# Altium project WR_NIC.PrjPcb (part 6 of 6)

## Sheet 20-Power-P1V8.SchDoc
size B; SheetNumber: 20; SheetTotal: 22; SPICEModelCachePRDMSQGY: <root> / <DocumentId>PRDMSQGY</DocumentId> / <CacheFrame Number="0"> / <Model Name="emk105bj105_v-f" Kind="CKT"> / <Text>* EMK105BJ105_V-F     SPICE MODEL  ( General Type ) / *-------------------------------------------------------------------------------------------------------- / * Model Generated by TAIYO YUDEN Corporation (http://www.ty-top.com) / * Version 1.0 / * TAIYO YUDEN Control No. 170508_130520 / * Copyright(c) 2012 TAIYO YUDEN CO.,LTD. All Rights Reserved. / *-------------------------------------------------------------------------------------------------------- / * / * Products Name : Multilayer Ceramic Capacitors / * / * Characteristics : / *     Capacitance : 1 uF , Rated Voltage : 16V , TCC : X5R / *     Case Size : 1.0 x 0.5 / 0.039 x 0.02 [mm/inch] , Thickness : 0.5 / 0.02 [mm/inch] / *     (Conditions: Temperature = 25 degC , DC Bias Current/Voltage = 0A / 0V) / * / * Frequency Range : 40Hz - 3GHz / * / * External Node Assignments : / * / *  1  o---| |---o  2 / * / *-------------------------------------------------------------------------------------------------------- / .SubCkt EMK105BJ105_V-F 1 2 / **************************** / C0 1 110 0.68309u / Cm 1 101 0.26053u / C1 101 102 0.94076u / Rc1 101 102 1.9029k / C2 102 103 0.66707u / Rc2 102 103 120.36 / C3 103 110 0.57203u / Rc3 103 110 2.1097 / C2m 1 301 0.1871u / C21 301 302 3.2494u / Rc21 301 302 1.1117k / C22 302 303 2.1014u / Rc22 302 303 1.484k / C23 303 304 2.1172u / Rc23 303 304 1.3876k / C24 304 305 0.75729u / Rc24 304 305 332.59 / C25 305 306 0.94401u / Rc25 305 306 249.09 / C26 306 307 0.34674u / Rc26 306 307 28.352 / C27 307 308 0.37158u / Rc27 307 308 19.989 / C28 308 309 0.17933u / Rc28 308 309 31.748 / C29 309 110 0.016445u / Rc29 309 110 1.0592 / Rp0 1 110 100Meg / L0 110 120 0.2216n / Lm 120 130 0.1509n / L1 120 121 0.12659n / RL1 121 130 0.85161 / L2 120 122 0.15996n / RL2 122 130 0.42469 / L3 120 123 7.9543n / RL3 123 130 0.54643m / CR 120 124 0.24334u / LR 124 125 0.090738n / RR 125 130 68.076m / CL 130 140 2.7354p / LL 130 140 0.10762n / RL 130 140 50.614 / Rs 140 2 7.5416m / **************************** / .ends EMK105BJ105_V-F</Text> / </Model> / </CacheFrame> / </root>
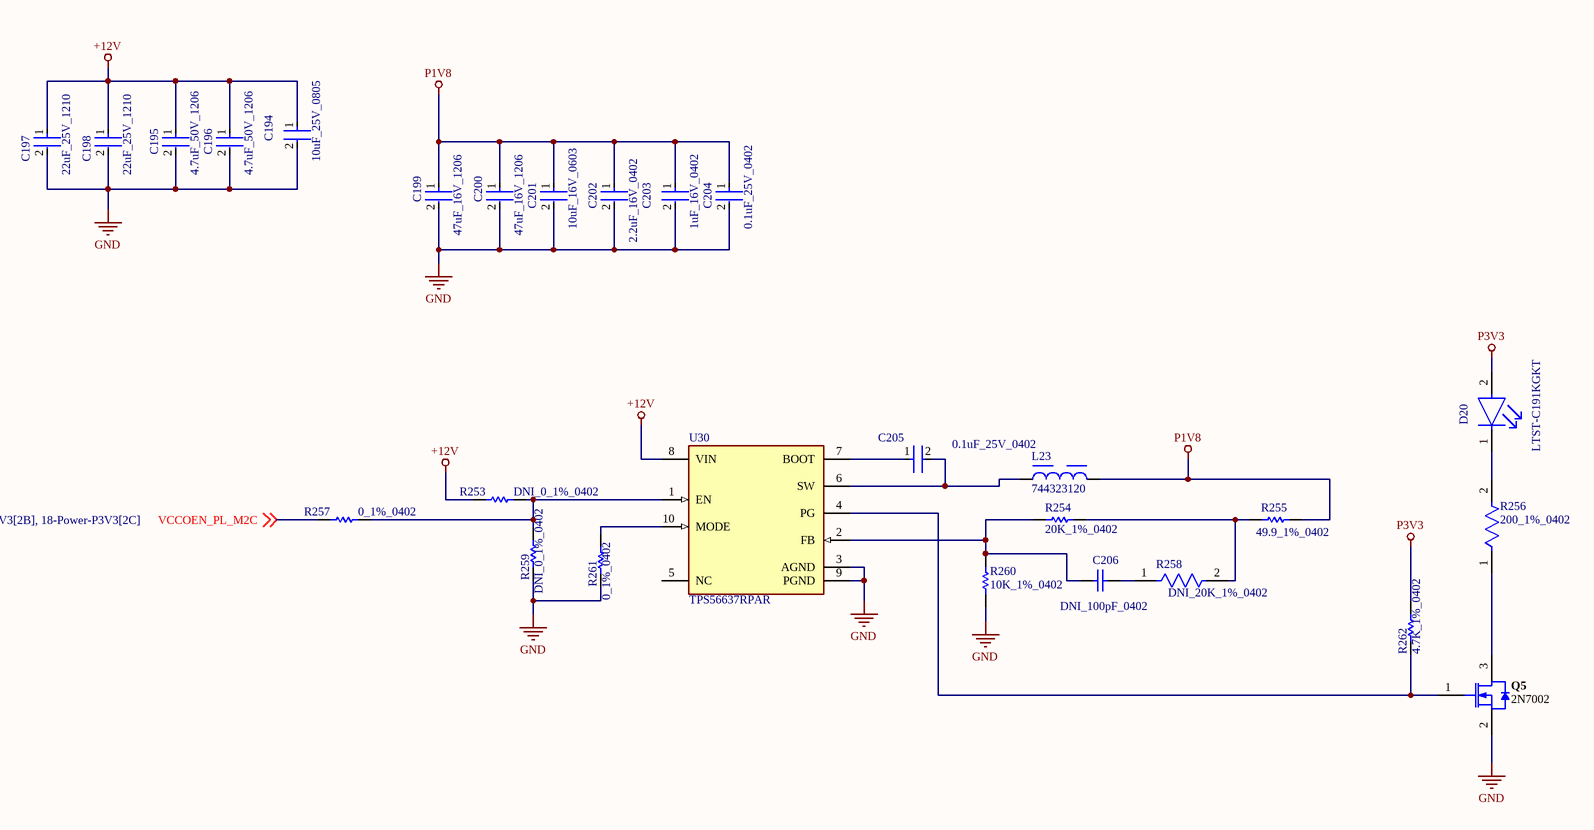
[diagram p20: 20-Power-P1V8.SchDoc]

### Parts
C194  10uF_25V_0805  [FP-0805-L_2_0_0_2-W_1_25-MFG]
C195  4.7uF_50V_1206  [FP-GRM31C-0_2-e0_3_0_8-IPC_C]
C196  4.7uF_50V_1206  [FP-GRM31C-0_2-e0_3_0_8-IPC_C]
C197  22uF_25V_1210  [FP-MK325M-MFG]
C198  22uF_25V_1210  [FP-MK325M-MFG]
C199  47uF_16V_1206  [FP-C3216-160-0_2-MFG]
C200  47uF_16V_1206  [FP-C3216-160-0_2-MFG]
C201  10uF_16V_0603  [FP-0603-L_1_6_0_2-W_0_8_0-MFG]
C202  2.2uF_16V_0402  [FP-C1005-050-0_05-IPC_A]
C203  1uF_16V_0402  [FP-0402-L_1_0_0_05-W_0_5-IPC_A]
C204  0.1uF_25V_0402  [FP-0402-L_1_0_1-W_0_5_0_1-IPC_C]
C205  0.1uF_25V_0402  [FP-0402-L_1_0_1-W_0_5_0_1-IPC_C]
C206  DNI_100pF_0402  [CAPC1005X55X25ML05T10]  (no BOM)
D20  LTST-C191KGKT  [FP-LTST-C191KGKT-MFG]
L23  744323120  [WE-HCI_1030]
Q5  2N7002  [INF-PG-SOT23_M]
R253  DNI_0_1%_0402  [RESC1005X40X25LL05T05]  (no BOM)
R254  20K_1%_0402  [RESC1005X40X25NL10T10]
R255  49.9_1%_0402  [RESC1005X40X25LL05T10]
R256  200_1%_0402  [FP-ERJ2RK-IPC_A]
R257  0_1%_0402  [RESC1005X40X25LL05T05]
R258  DNI_20K_1%_0402  [FP-ERJ2RK-MFG]  (no BOM)
R259  DNI_0_1%_0402  [RESC1005X40X25LL05T05]  (no BOM)
R260  10K_1%_0402  [RESC1005X40X25LL05T05]
R261  0_1%_0402  [RESC1005X40X25LL05T05]
R262  4.7K_1%_0402  [RESC1005X40X25NL10T10]
U30  TPS56637RPAR  [FP-RPA0010A-MFG]

### Nets
+12V: C194.1 C195.1 C196.1 C197.1 C198.1 R253.1 U30.8(VIN)
GND: C194.2 C195.2 C196.2 C197.2 C198.2 C199.2 C200.2 C201.2 C202.2 C203.2 C204.2 Q5.2(SOURCE) R259.1 R260.1 R261.1 U30.3(AGND) U30.9(PGND)
P1V8: C199.1 C200.1 C201.1 C202.1 C203.1 C204.1 L23.2 R255.2
P3V3: D20.2(A) R262.2
VCCOEN_PL_M2C: R257.1 ; off-sheet VCCOEN_PL_M2C
NetC205_1: C205.1 U30.7(BOOT)
NetC205_2: C205.2 L23.1 U30.6(SW)
NetC206_1: C206.1 R254.1 R260.2 U30.2(FB)
NetC206_2: C206.2 R258.1
NetD20_1: D20.1(C) R256.2
NetQ5_1: Q5.1(GATE) R262.1 U30.4(PG)
NetQ5_3: Q5.3(DRAIN) R256.1
NetR253_2: R253.2 R257.2 R259.2 U30.1(EN)
NetR254_2: R254.2 R255.1 R258.2
NetR261_2: R261.2 U30.10(MODE)

Not connected (* = marked no-connect by the designer): U30 5(NC)

### Library data of the parts
C194 = CMP-14477-000079-3: as C161 on sheet 18-Power-P3V3; Number of Pins: 2; Width: 0.049inch; REACH SVHC: No SVHC; Packaging: Tape and Reel; Max Operating Temperature: 85°C; Length: 0.079inch; Termination: SMD/SMT; RoHS Compliant: Yes; Thickness: 0.053inch; Case/Package: 0805; Case Code (Imperial): 0805; Capacitance: 10uF; Lead Free: Lead Free; Voltage Rating: 25V; Resistor Type: Ceramic; Voltage Rating (DC): 25V; Case Code (Metric): 2012; Mount: Surface Mount; Package Quantity: 1; Height: 1.25mm; Series: M; Tolerance: 10%; Min Operating Temperature: -55°C
C195 C196 = CMP-1037-04923-3: as C162 on sheet 18-Power-P3V3; Height: 1.6mm; Voltage: 50V; Capacitance: 4.7uF; Lead Free: Lead Free; Max Operating Temperature: 125°C; Packaging: Tape and Reel; REACH SVHC: No SVHC; Voltage Rating: 50V; Mount: Surface Mount; Termination: SMD/SMT; Tolerance: 10%; Case/Package: 1206; Material: Ceramic; Depth: 1.6mm; Length: 3.2mm; Case Code (Metric): 3216; Voltage Rating (DC): 50V; Case Code (Imperial): 1206; Radiation Hardening: No; Width: 0.063inch; Thickness: 0.071inch; Package Quantity: 2000; Min Operating Temperature: -55°C; Dielectric: X7R
C197 C198 = CMP-14477-000145-1: as C164 on sheet 18-Power-P3V3; Width: 0.098inch; Thickness: 0.106inch; Depth: 2.5mm; Packaging: Tape and Reel; Max Operating Temperature: 85°C; Termination: SMD/SMT; Case Code (Imperial): 1210; Height: 2.5mm; Case/Package: 1210; Voltage Rating: 25V; Package Quantity: 1; Min Operating Temperature: -55°C; Capacitance: 22uF; Halogen Free: Halogen Free; Case Code (Metric): 3225; Mount: Surface Mount; Construction: Flat; Radiation Hardening: No; Length: 3.2mm; Voltage Rating (DC): 25V; Contact Plating: Nickel; Number of Pins: 2; Dielectric: X5R; RoHS Compliant: Yes; Resistor Type: Ceramic; Series: M
C199 C200 = CMP-2000-07442-2: as C166 on sheet 18-Power-P3V3; Resistor Type: Ceramic; Width: 0.063inch; Case Code (Imperial): 1206; Radiation Hardening: No; Thickness: 0.071inch; Dielectric: X5R; Weight: 0.000571oz; Termination: SMD/SMT; Dielectric Material: Ceramic; Min Operating Temperature: -55°C; Depth: 1.6mm; Case Code (Metric): 3216; Max Operating Temperature: 85°C; RoHS Compliant: Yes; REACH SVHC: No SVHC; Mount: Surface Mount; Lead Free: Lead Free; Height: 1.6mm; Length: 3.2mm; Tolerance: 20%; Voltage Rating (DC): 16V; Capacitance: 47uF; Package Quantity: 1; Construction: Flat; Packaging: Tape and Reel; Series: C; Case/Package: 1206; Voltage Rating: 16V
C201 = CMP-2000-06226-4: as C168 on sheet 18-Power-P3V3; Packaging: Tape and Reel; Construction: Flat; Height: 0.8mm; Max Operating Temperature: 85°C; Dielectric: X5R; Case Code (Metric): 1608; Voltage Rating (DC): 16V; Width: 0.031inch; Voltage Rating: 16V; Length: 0.063inch; RoHS Compliant: Yes; Halogen Free: Halogen Free; Case Code (Imperial): 0603; Capacitance: 10uF; Mount: Surface Mount; Thickness: 0.031inch; Tolerance: 20%; Min Operating Temperature: -55°C; Series: M; Termination: SMD/SMT; Case/Package: 0603; Package Quantity: 1
C202 = CMP-2000-05998-2: as C169 on sheet 18-Power-P3V3; REACH SVHC: No SVHC; Series: C; Termination: SMD/SMT; Case Code (Imperial): 0402; Depth: 0.5mm; Mount: Surface Mount; Width: 0.02inch; Package Quantity: 1; Dielectric Material: Ceramic; Length: 1mm; Packaging: Tape and Reel; Case Code (Metric): 1005; RoHS Compliant: Yes; Dielectric: X5R; Max Operating Temperature: 85°C; Lead Free: Lead Free; Weight: 2.3E-05oz; Thickness: 0.022inch; Voltage Rating (DC): 16V; Tolerance: 10%; Voltage Rating: 16V; Resistor Type: Ceramic; Height: 0.5mm; Case/Package: 0402; Min Operating Temperature: -55°C
C203 = CMP-14477-000104-2: as C177 on sheet 18-Power-P3V3; Packaging: Tape and Reel; Depth: 0.5mm; Mount: Surface Mount; Thickness: 0.022inch; Package Quantity: 1; Min Operating Temperature: -55°C; Series: M; Voltage Rating (DC): 16V; Termination: SMD/SMT; Case/Package: 0402; Number of Pins: 2; Case Code (Imperial): 0402; Length: 1mm; Halogen Free: Halogen Free; Case Code (Metric): 1005; Width: 0.02inch; RoHS Compliant: Yes; Radiation Hardening: No; Max Operating Temperature: 85°C; Height: 0.5mm; Construction: Flat
C204 C205 = CMP-2008-02519-2: as C158 on sheet 17-FPGA-02b; Package Quantity: 1; Capacitance: 100nF; Min Operating Temperature: -55°C; Voltage: 25V; Voltage Rating: 25V; Construction: Flat; Max Operating Temperature: 125°C; Radiation Hardening: No; Depth: 0.5mm; Thickness: 0.022inch; Voltage Rating (DC): 25V; Number of Pins: 2; Lead Free: Lead Free; Series: -; REACH SVHC: No SVHC; Length: 1mm; Dielectric: X7R; RoHS Compliant: Yes; Mount: Surface Mount; Packaging: Tape and Reel; Case/Package: 0402; Case Code (Imperial): 0402; Termination: SMD/SMT; Width: 0.02inch; Case Code (Metric): 1005; Tolerance: 10%
C206 = CMP-2008-03915-1: as C180 on sheet 18-Power-P3V3
D20 = CMP-2000-05198-2: as D12 on sheet 18-Power-P3V3; Width: 0.8mm; Case Code (Imperial): 0603; Number of Pins: 2; Lead Free: Lead Free; Packaging: Tape and Reel; Package Quantity: 1; Min Operating Temperature: -55°C; Case/Package: 0603; Length: 1.6mm; Power Dissipation: 75mW; Depth: 0.8mm; Radiation Hardening: No; Mount: Surface Mount; Max Operating Temperature: 85°C; Color: Green; Power Rating: 75mW; Height: 0.55mm; Illumination Color: Green; Case Code (Metric): 1608; Lens Transparency: Clear; Number of Elements: 1
L23 = CMP-0226-00168-2: NexarPartId: 23379116; Self Resonant Frequency: 59MHz; Max DC Current: 12A; DC Resistance (DCR): 6.6mΩ; Shielding: Shielded; Saturation Current: 15A; Inductance Tolerance: 20%; Inductance: 1.2µH; Series Resistance: 6.6Ω; Test Frequency: 100kHz; Termination: SMD/SMT; Length: 10.6mm; REACH SVHC: No SVHC; Case/Package: Nonstandard; Width: 10.6mm; Min Operating Temperature: -40°C; Composition: Wirewound; Ambient Temperature Range Low: -40°C; Number of Pins: 2; Current Rating: 12A; Depth: 10.6mm; Height - Seated (Max): 3.0988mm; Max Operating Temperature: 150°C; Ambient Temperature Range High: 100°C; Packaging: Tape & Reel (TR); Mount: Surface Mount; Height: 2.8mm; Tolerance: 20%; RoHS: Compliant
Q5 = CMP-1149-00026-1: N-Channel OptiMOS Small-Signal-Transistor, 60 V VDS, 0.3 A ID, -55 to 150 degC, PG-SOT23, Reel, Green; Manufacturer: Infineon; RDS (on) (max) (@4.5V): 4,000 mOhm; VDS (max): 60 V; IDpuls (max): 1.2Â A; QG: 0.4Â nC; RDS (on) (max): 3,000 mOhm; RthJA (max): 250 K/W; ID (max): 0.3Â A; VGS(th) (max): 2.5Â V; VGS(th) (min): 1.5Â V; Green: TRUE; Ptot (max): 0.5Â W; PackageDescription: 3-Pin Small Outline Transistor Package, 2.9 x 1.3 mm Body, 0.95 mm Pitch; Halogen-free: TRUE; ComponentLink2Description: Datasheet; ComponentLink1URL: http://www.infineon.com/; Packing: Reel; DatasheetVersion: Rev. 2.4; PartNumber: 2N7002; PackageReference: PG-SOT23; PackageVersion: Apr-08; ComponentLink3URL: http://www.infineon.com/dgdl/SOT23-Package_Overview.pdf?folderId=db3a30431936bc4b0119532290053c66&fileId=db3a30431936bc4b0119533468123c85; ComponentLink1Description: Manufacturer URL; Mounting Technology: Surface Mount; ComponentLink3Description: Package Specification; ComponentLink2URL: http://www.infineon.com/dgdl/2N7002_Rev2.4.pdf?folderId=db3a3043156fd573011622e10b5c1f67&fileId=db3a304319bc939a0119c2a9461e79e6
R253 R257 R259 R261 = CMP-2000-07451-1: as R153 on sheet 17-FPGA-02b; Number of Terminations: 2; Mount: SurfaceMount; Height: 0.35mm; Packaging: TapeandReel; Contact Plating: Tin; Manufacturer URL: http://www.panasonic.com/; Composition: ThickFilm; Max Operating Temperature: 155degC; REACH SVHC: NoSVHC; Case/Package: 0402; Package Reference: 402; Depth: 0.5mm; Package Description: 2-Pin Surface Mount Device, Body 1 x 0.5 mm; Datasheet URL: https://industrial.panasonic.com/cdbs/www-data/pdf/RDA0000/AOA0000C301.pdf; RoHSCompliant: True; Case Code (Imperial): 0402; Military Standard: Not; Min Operating Temperature: -55degC; Power Rating: 100mW; Datasheet Version: 03/2015; Length: 1mm; Case Code (Metric): 1005; Termination: SMD/SMT; Mounting Technology: SurfaceMount; Voltage Rating: 50V; Width: 0.02inch; Package Quantity: 1; Lead Free: LeadFree; Radiation Hardening: No
R254 = CMP-2002-06039-1: as R173 on sheet 19-Power-P5V
R255 = CMP-2002-07709-1: as R159 on sheet 18-Power-P3V3
R256 = CMP-2002-00757-2: as R155 on sheet 18-Power-P3V3; RoHS Compliant: Yes; Packaging: Tape and Reel; Case Code (Metric): 1005; Package Quantity: 1; Contact Plating: Tin; Series: ERJ; Mount: Surface Mount; Lead Free: Lead Free; Min Operating Temperature: -55°C; Number of Terminations: 2; Max Power Dissipation: 100mW; Technology: THICK FILM; Voltage Rating: 50V; Case/Package: 0402; Width: 0.02inch; Termination: SMD/SMT; Military Standard: Not; Height: 0.35mm; Radiation Hardening: No; Resistance Tolerance: 1%; Length: 1mm; REACH SVHC: No SVHC; Construction: Rectangular; Depth: 0.5mm; Features: Automotive AEC-Q200; Resistor Type: Thick Film; Case Code (Imperial): 0402; Tolerance: 1%; Size Code: 0402; Max Operating Temperature: 155°C
R258 = CMP-2002-00759-4: as R160 on sheet 18-Power-P3V3; Radiation Hardening: No; Case/Package: 0402; Case Code (Metric): 1005; Min Operating Temperature: -55°C; Termination: SMD/SMT; Package Quantity: 1; Length: 1mm; Case Code (Imperial): 0402; Lead Free: Lead Free; Height: 0.35mm; Max Operating Temperature: 155°C; Depth: 0.5mm; Number of Terminations: 2; Military Standard: Not; Max Power Dissipation: 100mW; Tolerance: 1%; Composition: Thick Film; Weight: 2.8E-05oz; Features: Automotive AEC-Q200; Voltage Rating: 50V; Contact Plating: Tin; REACH SVHC: No SVHC; Width: 0.02inch; Packaging: Cut Tape; Mount: Surface Mount
R260 = CMP-2000-07588-1: as R152 on sheet 17-FPGA-02b; RoHSCompliant: True; Lead Free: LeadFree; Package Quantity: 1; Contact Plating: Tin; Length: 1mm; Radiation Hardening: No; REACH SVHC: NoSVHC; Max Operating Temperature: 155degC; Depth: 0.5mm; Case Code (Imperial): 0402; Military Standard: Not; Package Description: 2-Pin Surface Mount Device, Body 1 x 0.5 mm; Termination: SMD/SMT; Case Code (Metric): 1005; Height: 0.35mm; Packaging: TapeandReel; Voltage Rating (DC): 50V; Package Reference: 402; Number of Pins: 2; Tolerance: 1%; Mounting Technology: SurfaceMount; Width: 0.02inch; Mount: SurfaceMount; Datasheet URL: https://industrial.panasonic.com/cdbs/www-data/pdf/RDA0000/AOA0000C304.pdf; Composition: ThickFilm; Datasheet Version: 02/2017; Manufacturer URL: http://www.panasonic.com/; Max Power Dissipation: 100mW; Number of Terminations: 2; Min Operating Temperature: -55degC
R262 = CMP-2002-05217-1: Manufacturer: Bourns; Part Number: CR0402-FX-4701GLF
U30 = CMP-04918-000008-1: as U28 on sheet 18-Power-P3V3; Automotive: No; Manufacturer Part Number: TPS56637RPAR; Lead Free: Yes; Temperature Range Low: -40°C; Digikey Description: IC POWER MANAGEMENT; Octopart: https://octopart.com/tps56637rpar-texas+instruments-97650653; Temperature: -40°C to +150°C; Device Class L3: Voltage Regulators - Switching; Temperature Range High: +150°C; Package: RPA0010A; Device Class L2: Power Management ICs; ComponentLink2URL: http://www.ti.com/lit/ds/symlink/tps56637.pdf; Device Class L1: Integrated Circuits (ICs); RoHS: TRUE; ComponentLink2Description: Datasheet; Height: 1mm; Category: IC

## Sheet 21-M2_GNSS.SchDoc
size B; SheetNumber: 21; SheetTotal: 22
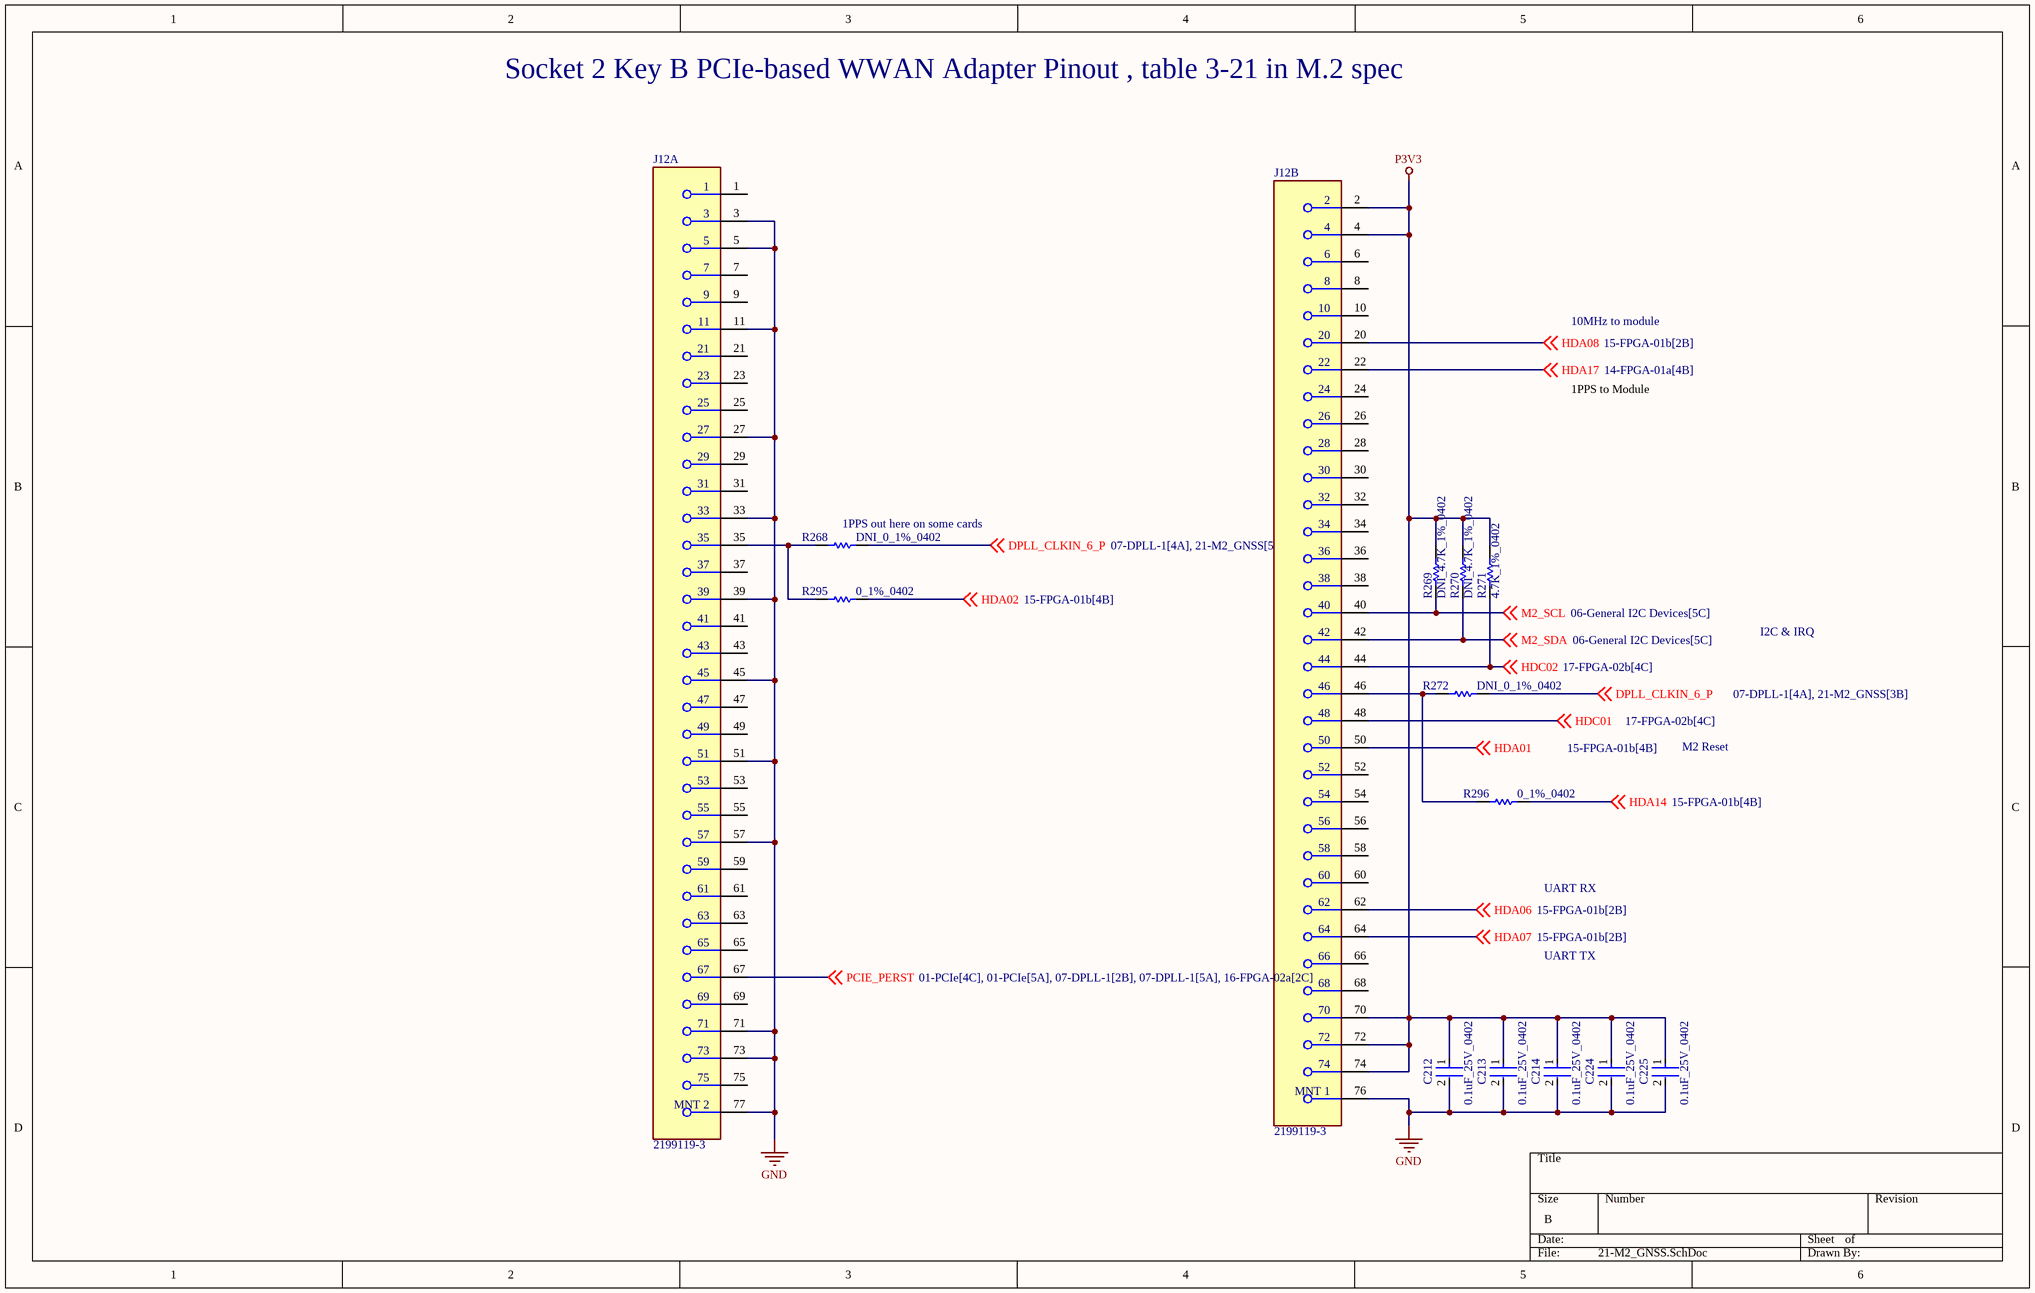
[diagram p21: 21-M2_GNSS.SchDoc]

### Parts
C212  0.1uF_25V_0402  [FP-0402-L_1_0_1-W_0_5_0_1-IPC_C]
C213  0.1uF_25V_0402  [FP-0402-L_1_0_1-W_0_5_0_1-IPC_C]
C214  0.1uF_25V_0402  [FP-0402-L_1_0_1-W_0_5_0_1-IPC_C]
C224  0.1uF_25V_0402  [FP-0402-L_1_0_1-W_0_5_0_1-IPC_C]
C225  0.1uF_25V_0402  [FP-0402-L_1_0_1-W_0_5_0_1-IPC_C]
J12  2199119-3  [FP-2199119-3-MFG]  (parts A,B of 2)
R268  DNI_0_1%_0402  [RESC1005X40X25LL05T05]  (no BOM)
R269  DNI_4.7K_1%_0402  [RESC1005X40X25NL10T10]  (no BOM)
R270  DNI_4.7K_1%_0402  [RESC1005X40X25NL10T10]  (no BOM)
R271  4.7K_1%_0402  [RESC1005X40X25NL10T10]
R272  DNI_0_1%_0402  [RESC1005X40X25LL05T05]  (no BOM)
R295  0_1%_0402  [RESC1005X40X25LL05T05]
R296  0_1%_0402  [RESC1005X40X25LL05T05]

### Nets
GND: C212.2 C213.2 C214.2 C224.2 C225.2 J12.3 J12.5 J12.11 J12.27 J12.33 J12.39 J12.45 J12.51 J12.57 J12.71 J12.73 J12.76(MNT_1) J12.77(MNT_2)
P3V3: C212.1 C213.1 C214.1 C224.1 C225.1 J12.2 J12.4 J12.70 J12.72 J12.74 R269.2 R270.2 R271.2
DPLL_CLKIN_6_P: R268.2 R272.2 ; off-sheet DPLL_CLKIN_6_P
HDA01: J12.50 ; off-sheet HDA01
HDA02: R295.2 ; off-sheet HDA02
HDA06: J12.62 ; off-sheet HDA06
HDA07: J12.64 ; off-sheet HDA07
HDA08: J12.20 ; off-sheet HDA08
HDA14: R296.2 ; off-sheet HDA14
HDA17: J12.22 ; off-sheet HDA17
HDC01: J12.48 ; off-sheet HDC01
HDC02: J12.44 R271.1 ; off-sheet HDC02
M2_SCL: J12.40 R269.1 ; off-sheet M2_SCL
M2_SDA: J12.42 R270.1 ; off-sheet M2_SDA
PCIE_PERST: J12.67 ; off-sheet PCIE_PERST
NetJ12_35: J12.35 R268.1 R295.1
NetJ12_46: J12.46 R272.1 R296.1

Not connected (* = marked no-connect by the designer): J12 1 6 7 8 9 10 21 23 24 25 26 28 29 30 31 32 34 36 37 38 41 43 47 49 52 53 54 55 56 58 59 60 61 63 65 66 68 69 75

### Notes on the sheet
- Socket 2 Key B PCIe-based WWAN Adapter Pinout , table 3-21 in M.2 spec
- 10MHz to module
- 1PPS to Module
- (near R268) 1PPS out here on some cards
- I2C & IRQ
- M2 Reset
- UART RX
- UART TX

### Library data of the parts
C212-C214 C224 C225 = CMP-2008-02519-2: as C158 on sheet 17-FPGA-02b; Package Quantity: 1; Capacitance: 100nF; Min Operating Temperature: -55°C; Voltage: 25V; Voltage Rating: 25V; Construction: Flat; Max Operating Temperature: 125°C; Radiation Hardening: No; Depth: 0.5mm; Thickness: 0.022inch; Voltage Rating (DC): 25V; Number of Pins: 2; Lead Free: Lead Free; Series: -; REACH SVHC: No SVHC; Length: 1mm; Dielectric: X7R; RoHS Compliant: Yes; Mount: Surface Mount; Packaging: Tape and Reel; Case/Package: 0402; Case Code (Imperial): 0402; Termination: SMD/SMT; Width: 0.02inch; Case Code (Metric): 1005; Tolerance: 10%
J12 = CMP-03365-000004-1: CONN M.2 FEMALE 67POS 0.020 GOLD; Contact Current Rating: 500mA; Number of Contacts: 67; PCB Mounting Orientation: Right Angle; Pitch: 0.5mm; Voltage Rating: 50V; Insulation Resistance: 500MR; Row Spacing: 7.55mm; Orientation: Right Angle; Length: 0.862inch; Radiation Hardening: No; Mount: Surface Mount; Contact Plating: Gold; Contact Material: Copper Alloy; Width: 8.7mm; Number of Rows: 2; Color: Black; ELV: Compliant; Housing Color: Black; Number of Positions: 67; Housing Material: Thermoplastic; Gender: Female; Min Operating Temperature: -40°C; Max Operating Temperature: 80°C; RoHS Compliant: Yes; Package Quantity: 1200; Packaging: Tape and Reel; Height: 3.2mm; Termination: Solder; Insulation Material: Thermoplastic; Max Voltage Rating (AC): 50V; Current Rating: 500mA
R268 R272 R295 R296 = CMP-2000-07451-1: as R153 on sheet 17-FPGA-02b; Number of Terminations: 2; Mount: SurfaceMount; Height: 0.35mm; Packaging: TapeandReel; Contact Plating: Tin; Manufacturer URL: http://www.panasonic.com/; Composition: ThickFilm; Max Operating Temperature: 155degC; REACH SVHC: NoSVHC; Case/Package: 0402; Package Reference: 402; Depth: 0.5mm; Package Description: 2-Pin Surface Mount Device, Body 1 x 0.5 mm; Datasheet URL: https://industrial.panasonic.com/cdbs/www-data/pdf/RDA0000/AOA0000C301.pdf; RoHSCompliant: True; Case Code (Imperial): 0402; Military Standard: Not; Min Operating Temperature: -55degC; Power Rating: 100mW; Datasheet Version: 03/2015; Length: 1mm; Case Code (Metric): 1005; Termination: SMD/SMT; Mounting Technology: SurfaceMount; Voltage Rating: 50V; Width: 0.02inch; Package Quantity: 1; Lead Free: LeadFree; Radiation Hardening: No
R269-R271 = CMP-2002-05217-1: as R262 on sheet 20-Power-P1V8

## Sheet 22-1G_SFP.SchDoc
size B; SheetNumber: 22; SheetTotal: 22
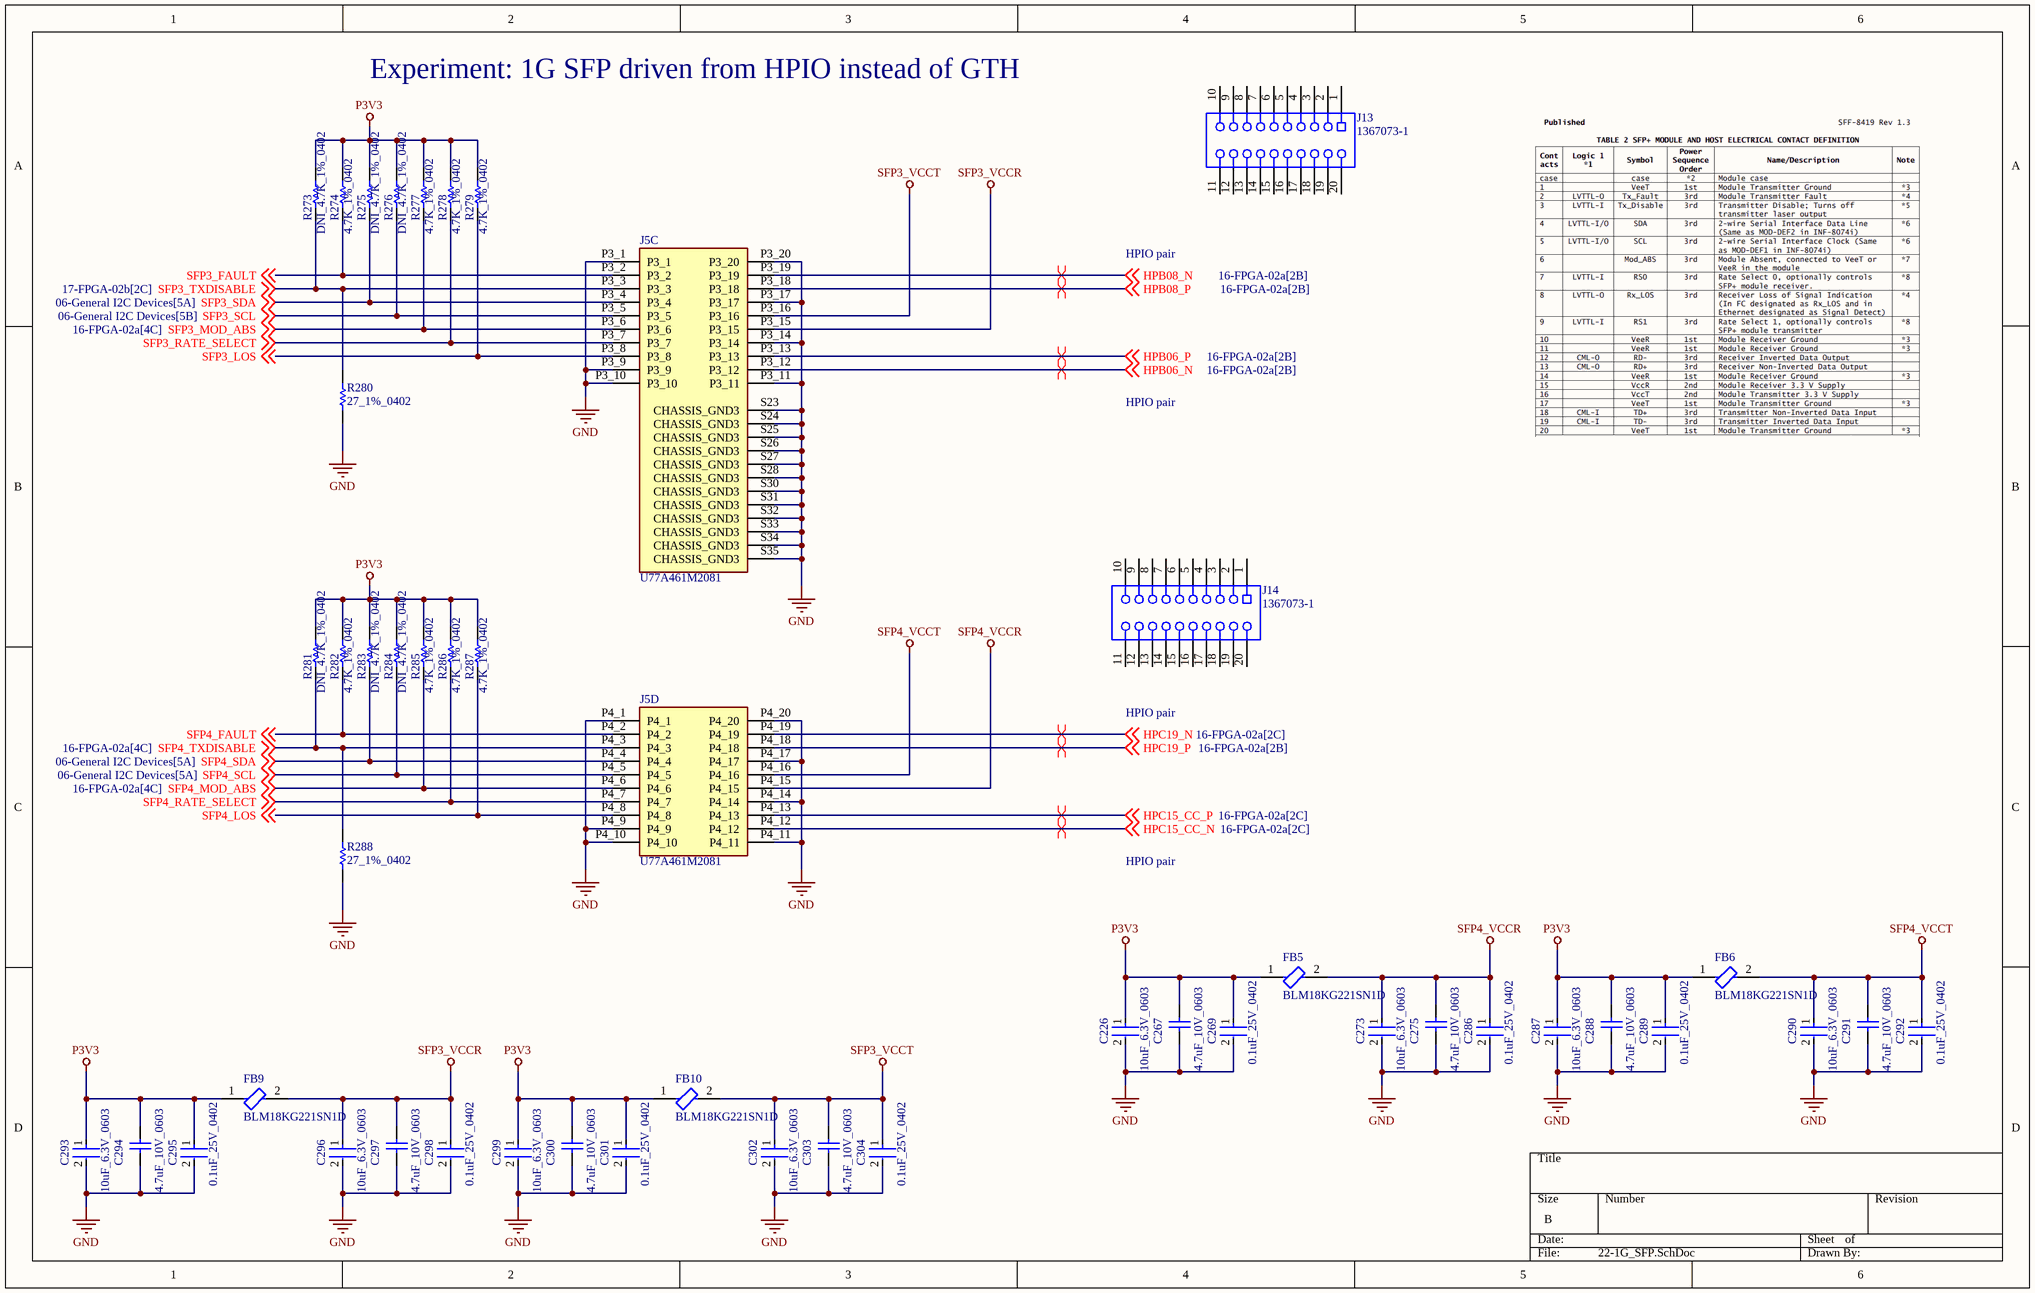
[diagram p22: 22-1G_SFP.SchDoc]

### Parts
C226  10uF_6.3V_0603  [FP-C0603C106M9PACTU-MFG]
C267  4.7uF_10V_0603  [CAPC1608X87X35NL15T15]
C269  0.1uF_25V_0402  [FP-0402-L_1_0_1-W_0_5_0_1-IPC_C]
C273  10uF_6.3V_0603  [FP-C0603C106M9PACTU-MFG]
C275  4.7uF_10V_0603  [CAPC1608X87X35NL15T15]
C286  0.1uF_25V_0402  [FP-0402-L_1_0_1-W_0_5_0_1-IPC_C]
C287  10uF_6.3V_0603  [FP-C0603C106M9PACTU-MFG]
C288  4.7uF_10V_0603  [CAPC1608X87X35NL15T15]
C289  0.1uF_25V_0402  [FP-0402-L_1_0_1-W_0_5_0_1-IPC_C]
C290  10uF_6.3V_0603  [FP-C0603C106M9PACTU-MFG]
C291  4.7uF_10V_0603  [CAPC1608X87X35NL15T15]
C292  0.1uF_25V_0402  [FP-0402-L_1_0_1-W_0_5_0_1-IPC_C]
C293  10uF_6.3V_0603  [FP-C0603C106M9PACTU-MFG]
C294  4.7uF_10V_0603  [CAPC1608X87X35NL15T15]
C295  0.1uF_25V_0402  [FP-0402-L_1_0_1-W_0_5_0_1-IPC_C]
C296  10uF_6.3V_0603  [FP-C0603C106M9PACTU-MFG]
C297  4.7uF_10V_0603  [CAPC1608X87X35NL15T15]
C298  0.1uF_25V_0402  [FP-0402-L_1_0_1-W_0_5_0_1-IPC_C]
C299  10uF_6.3V_0603  [FP-C0603C106M9PACTU-MFG]
C300  4.7uF_10V_0603  [CAPC1608X87X35NL15T15]
C301  0.1uF_25V_0402  [FP-0402-L_1_0_1-W_0_5_0_1-IPC_C]
C302  10uF_6.3V_0603  [FP-C0603C106M9PACTU-MFG]
C303  4.7uF_10V_0603  [CAPC1608X87X35NL15T15]
C304  0.1uF_25V_0402  [FP-0402-L_1_0_1-W_0_5_0_1-IPC_C]
FB5  BLM18KG221SN1D  [FP-BLM18-0_15-t0_8-IPC_B]
FB6  BLM18KG221SN1D  [FP-BLM18-0_15-t0_8-IPC_B]
FB9  BLM18KG221SN1D  [FP-BLM18-0_15-t0_8-IPC_B]
FB10  BLM18KG221SN1D  [FP-BLM18-0_15-t0_8-IPC_B]
J5  U77A461M2081  [AMPHENOL_U77A461M2081]  (parts C,D of 4)
J13  1367073-1  [TECO-1367073-1_V]
J14  1367073-1  [TECO-1367073-1_V]
R273  DNI_4.7K_1%_0402  [RESC1005X40X25NL10T10]  (no BOM)
R274  4.7K_1%_0402  [RESC1005X40X25NL10T10]
R275  DNI_4.7K_1%_0402  [RESC1005X40X25NL10T10]  (no BOM)
R276  DNI_4.7K_1%_0402  [RESC1005X40X25NL10T10]  (no BOM)
R277  4.7K_1%_0402  [RESC1005X40X25NL10T10]
R278  4.7K_1%_0402  [RESC1005X40X25NL10T10]
R279  4.7K_1%_0402  [RESC1005X40X25NL10T10]
R280  27_1%_0402  [RESC1005X40X25NL05T05]
R281  DNI_4.7K_1%_0402  [RESC1005X40X25NL10T10]  (no BOM)
R282  4.7K_1%_0402  [RESC1005X40X25NL10T10]
R283  DNI_4.7K_1%_0402  [RESC1005X40X25NL10T10]  (no BOM)
R284  DNI_4.7K_1%_0402  [RESC1005X40X25NL10T10]  (no BOM)
R285  4.7K_1%_0402  [RESC1005X40X25NL10T10]
R286  4.7K_1%_0402  [RESC1005X40X25NL10T10]
R287  4.7K_1%_0402  [RESC1005X40X25NL10T10]
R288  27_1%_0402  [RESC1005X40X25NL05T05]

### Nets
GND: C226.2 C267.1 C269.2 C273.2 C275.1 C286.2 C287.2 C288.1 C289.2 C290.2 C291.1 C292.2 C293.2 C294.1 C295.2 C296.2 C297.1 C298.2 C299.2 C300.1 C301.2 C302.2 C303.1 C304.2 J5.P3_1 J5.P3_9 J5.P3_10 J5.P3_11 J5.P3_14 J5.P3_17 J5.P3_20 J5.P4_1 J5.P4_9 J5.P4_10 J5.P4_11 J5.P4_14 J5.P4_17 J5.P4_20 J5.S23(CHASSIS_GND3) J5.S24(CHASSIS_GND3) J5.S25(CHASSIS_GND3) J5.S26(CHASSIS_GND3) J5.S27(CHASSIS_GND3) J5.S28(CHASSIS_GND3) J5.S30(CHASSIS_GND3) J5.S31(CHASSIS_GND3) J5.S32(CHASSIS_GND3) J5.S33(CHASSIS_GND3) J5.S34(CHASSIS_GND3) J5.S35(CHASSIS_GND3) R280.1 R288.1
P3V3: C226.1 C267.2 C269.1 C287.1 C288.2 C289.1 C293.1 C294.2 C295.1 C299.1 C300.2 C301.1 FB5.1 FB6.1 FB9.1 FB10.1 R273.1 R274.1 R275.1 R276.1 R277.1 R278.1 R279.1 R281.1 R282.1 R283.1 R284.1 R285.1 R286.1 R287.1
SFP3_VCCR: C296.1 C297.2 C298.1 FB9.2 J5.P3_15
SFP3_VCCT: C302.1 C303.2 C304.1 FB10.2 J5.P3_16
SFP4_VCCR: C273.1 C275.2 C286.1 FB5.2 J5.P4_15
SFP4_VCCT: C290.1 C291.2 C292.1 FB6.2 J5.P4_16
HPB06_N: J5.P3_12 ; off-sheet HPB06_N
HPB06_P: J5.P3_13 ; off-sheet HPB06_P
HPB08_N: J5.P3_19 ; off-sheet HPB08_N
HPB08_P: J5.P3_18 ; off-sheet HPB08_P
HPC15_CC_N: J5.P4_12 ; off-sheet HPC15_CC_N
HPC15_CC_P: J5.P4_13 ; off-sheet HPC15_CC_P
HPC19_N: J5.P4_19 ; off-sheet HPC19_N
HPC19_P: J5.P4_18 ; off-sheet HPC19_P
SFP3_FAULT: J5.P3_2 R274.2 ; off-sheet SFP3_FAULT
SFP3_LOS: J5.P3_8 R279.2 ; off-sheet SFP3_LOS
SFP3_MOD_ABS: J5.P3_6 R277.2 ; off-sheet SFP3_MOD_ABS
SFP3_RATE_SELECT: J5.P3_7 R278.2 ; off-sheet SFP3_RATE_SELECT
SFP3_SCL: J5.P3_5 R276.2 ; off-sheet SFP3_SCL
SFP3_SDA: J5.P3_4 R275.2 ; off-sheet SFP3_SDA
SFP3_TXDISABLE: J5.P3_3 R273.2 R280.2 ; off-sheet SFP3_TXDISABLE
SFP4_FAULT: J5.P4_2 R282.2 ; off-sheet SFP4_FAULT
SFP4_LOS: J5.P4_8 R287.2 ; off-sheet SFP4_LOS
SFP4_MOD_ABS: J5.P4_6 R285.2 ; off-sheet SFP4_MOD_ABS
SFP4_RATE_SELECT: J5.P4_7 R286.2 ; off-sheet SFP4_RATE_SELECT
SFP4_SCL: J5.P4_5 R284.2 ; off-sheet SFP4_SCL
SFP4_SDA: J5.P4_4 R283.2 ; off-sheet SFP4_SDA
SFP4_TXDISABLE: J5.P4_3 R281.2 R288.2 ; off-sheet SFP4_TXDISABLE

Not connected (* = marked no-connect by the designer): J13 1 2 3 4 5 6 7 8 9 10 11 12 13 14 15 16 17 18 19 20; J14 1 2 3 4 5 6 7 8 9 10 11 12 13 14 15 16 17 18 19 20

### Layout directives
differential pair: HPB06_N, HPB06_P, HPB08_N, HPB08_P, HPC15_CC_N, HPC15_CC_P, HPC19_N, HPC19_P

### Notes on the sheet
- Experiment: 1G SFP driven from HPIO instead of GTH
- HPIO pair

### Library data of the parts
C226 C273 C287 C290 C293 C296 C299 C302 = CMP-2006-02285-3: CAP CER 10UF 6.3V X5R 0603; Manufacturer Part Number: C0603C106M9PACTU; Manufacturer: Kemet; Material: Ceramic; Temperature Coefficient: 15%; Tolerance: 20%; Category: Cap; Height: 0.9mm; Digikey Description: CAP CER 10UF 6.3V X5R 0603; Mouser Description: In a Pack of 10, KEMET 0603 (1608M) 10µF MLCC 6.3V dc ±20% SMD C0603C106M9PACTU; Voltage Rating: 6.3V; Device Class L2: Capacitors; Temperature Range Low: -55°C; Temperature Characteristic: X5R; ComponentLink2Description: Datasheet; Ipc Land Pattern Name: CAPC16080X80; ComponentLink2URL: http://www.kemet.com/Lists/ProductCatalog/Attachments/19/KEM_C1006_X5R_SMD.pdf; Capacitance: 10uF; Temperature Range High: +85°C; Device Class L3: Ceramic Capacitors; RoHS: TRUE; Automotive: No; Value: 10uF; Temperature: -55°C to +85°C; Device Class L1: Passive Components; Package: C0603C106M9PACTU; Lead Free: Yes; Octopart: https://octopart.com/c0603c106m9pactu-kemet-8375727
C267 C275 C288 C291 C294 C297 C300 C303 = CMP-2006-03238-1: Part Number: C0603C475K8PACTU; Manufacturer: Kemet
C269 C286 C289 C292 C295 C298 C301 C304 = CMP-2008-02519-2: as C158 on sheet 17-FPGA-02b; Package Quantity: 1; Capacitance: 100nF; Min Operating Temperature: -55°C; Voltage: 25V; Voltage Rating: 25V; Construction: Flat; Max Operating Temperature: 125°C; Radiation Hardening: No; Depth: 0.5mm; Thickness: 0.022inch; Voltage Rating (DC): 25V; Number of Pins: 2; Lead Free: Lead Free; Series: -; REACH SVHC: No SVHC; Length: 1mm; Dielectric: X7R; RoHS Compliant: Yes; Mount: Surface Mount; Packaging: Tape and Reel; Case/Package: 0402; Case Code (Imperial): 0402; Termination: SMD/SMT; Width: 0.02inch; Case Code (Metric): 1005; Tolerance: 10%
FB5 FB6 FB9 FB10 = CMP-0686-00556-7: Chip Ferrite Bead, 0603, 220Ω @ 100MHz, 0.05Ω, 25%, 2.2A; DC Resistance (DCR): 50mR; Number of Circuits: 1; Impedance: 220R; Current Rating: 2.2A; Material: Ferrite; Test Frequency: 100MHz; Depth: 0.8mm; Series: BLM18K; RoHS Compliant: Yes; Termination: SMD/SMT; Max Current Rating: 2.2A; Case Code (Metric): 1608; Radiation Hardening: No; Number of Pins: 2; Length: 1.6mm; Lead Free: Lead Free; Package Quantity: 1; Height: 0.8mm; Core Material: Ferrite; Inductor Type: FERRITE BEAD; Min Operating Temperature: -55°C; Case/Package: 0603; Case Code (Imperial): 0603; Number of Lines: 1; Packaging: Tape and Reel; REACH SVHC: No SVHC; Max Operating Temperature: 125°C; Military Standard: Not; DC Resistance-Max: 50mR; Width: 0.8mm; DC Current: 2.2A; Max DC Current: 2.2A; Tolerance: 25%; Weight: 7.1E-05oz
J5 = U77A461M2081: MF: AMPHENOL ICC / FCI; Package: None; Price: None; Value: *; MP: U77A461M2081; Availability: Unavailable
J13 J14 = CMP-2000-05488-1: Female Connector, Pitch 0.8 mm, 2 x 10 Position, Height 5.4 mm, -55 to 85 degC, RoHS, Tape and Reel; Manufacturer: TE Connectivity; Product Training Modules: HighSpeedPluggableI/OSolutions; 3D Model: 1367073-1.pdf; Connector Type: SFP; Other Names: A97430DKR; Mating Products: 516-2084-ND / -TXRXOPTICALSFF1.25GBDISCSI; Dynamic Catalog: SFPConnectors; Featured Product: HighSpeedPluggableI-OSolutions; Connector Style: Receptacle; Associated Product: A103997CT-ND / -CONNSFPCAGESINGLEW/OPIPE / A103997TR-ND / -CONNSFPCAGESINGLEW/OPIPE / 1367645-3-ND / -CONNCAGE&HEATSINKSGLPORTTIN / 1367645-2-ND / -CONNCAGE&HEATSINKSGLPORTTIN / 1888424-1-ND / -CONNCAGE1X2SFPENHANCEDEMI / 1367643-1-ND / -CONNCAGESNGLPORTDBLSIDETIN / 1489962-1-ND / -CONNSFPCAGESINGLEW/OPIPE / 1367645-1-ND / -CONNCAGE&HEATSINKSGLPORTTIN / A99375-ND / -CONNSFPCAGE1X4PIN-IN-PASTE / A97412CT-ND / -CONNSFPLOWERCAGEPCB / More...; Number of Positions: 20; Package Reference: 1367073-1; Package Description: Female Connector, Pitch 0.8 mm, 2 x 10 Position, Height 5.4 mm; RoHS Information: 1367073-1StatementofCompliance; Contact Finish: Gold; Datasheet URL: http://www.te.com/commerce/DocumentDelivery/DDEController?Action=showdoc&DocId=Customer+Drawing%7F1367073%7FK%7Fpdf%7FEnglish%7FENG_CD_1367073_K.pdf%7F1367073-1; Datasheet Version: Rev. K, 12/2012; Contact Finish Thickness: 15µin(0.38µm); Category: Connectors,Interconnects; Mounting Type: SurfaceMount,RightAngle; Mounting Technology: SurfaceMount; Packaging: Digi-Reel®; Manufacturer URL: http://www.te.com/; Family: PluggableConnectors; Standard Package: 1; Termination: Solder
R273-R279 R281-R287 = CMP-2002-05217-1: as R262 on sheet 20-Power-P1V8
R280 R288 = CMP-2002-08434-1: Part Number: CRCW040227R0FKED; Manufacturer: Vishay Dale

## Nets that join several sheets
+12V: 04-POWER-P12V (7 pins), 13-Experimental (J18.2), 18-Power-P3V3 (7 pins), 19-Power-P5V (7 pins), 20-Power-P1V8 (7 pins)
+12V_PCIE: 01-PCIe (5 pins), 04-POWER-P12V (CR1.1 R44.1)
DPLL_VDD_CLKA: 07-DPLL-1 (U4.71), 08-DPLL-2 (C247.1 C248.1 L15.2)
DPLL_VDD_CLKB: 07-DPLL-1 (U4.19), 08-DPLL-2 (C232.1 C233.1 L11.2)
DPLL_VDD_DCO_Q0123: 07-DPLL-1 (U4.62), 08-DPLL-2 (C215.1 C216.1 L7.2)
DPLL_VDD_DCO_Q4567: 07-DPLL-1 (U4.30), 08-DPLL-2 (C229.1 C230.1 L10.2)
DPLL_VDD_DIA_A: 07-DPLL-1 (U4.63), 08-DPLL-2 (C61.1 C62.1 L3.2)
DPLL_VDD_DIA_B: 07-DPLL-1 (U4.29), 08-DPLL-2 (C80.1 C81.1 L4.2)
DPLL_VDD_DIG: 07-DPLL-1 (U4.9), 08-DPLL-2 (5 pins)
DPLL_VDD_GPIO: 07-DPLL-1 (U4.46), 08-DPLL-2 (5 pins)
DPLL_VDDA_BG_LC: 07-DPLL-1 (U4.25 U4.26), 08-DPLL-2 (C71.1 C72.1 C73.1 L2.2)
DPLL_VDDA_FB: 07-DPLL-1 (U4.69), 08-DPLL-2 (C242.1 C243.1 L14.2)
DPLL_VDDA_PDCP_XTAL: 07-DPLL-1 (U4.68), 08-DPLL-2 (C170.1 C184.1 L6.2)
DPLL_VDDO_Q0: 07-DPLL-1 (U4.61), 08-DPLL-2 (C227.1 C228.1 L9.2)
DPLL_VDDO_Q1: 07-DPLL-1 (U4.55), 08-DPLL-2 (C244.1 C245.1 L13.2)
DPLL_VDDO_Q2: 07-DPLL-1 (U4.54), 08-DPLL-2 (C253.1 C254.1 L16.2)
DPLL_VDDO_Q3: 07-DPLL-1 (U4.50), 08-DPLL-2 (C262.1 C263.1 L18.2)
DPLL_VDDO_Q4: 07-DPLL-1 (U4.42), 08-DPLL-2 (C59.1 C60.1 L1.2)
DPLL_VDDO_Q5: 07-DPLL-1 (U4.38), 08-DPLL-2 (C84.1 C85.1 L5.2)
DPLL_VDDO_Q6: 07-DPLL-1 (U4.37), 08-DPLL-2 (C220.1 C221.1 L8.2)
DPLL_VDDO_Q7: 07-DPLL-1 (U4.31), 08-DPLL-2 (C238.1 C239.1 L12.2)
GND: 01-PCIe (50 pins), 02-USER_IO (15 pins), 04-POWER-P12V (9 pins), 05-Front Panel SFP+ (62 pins), 06-General I2C Devices (17 pins), 07-DPLL-1 (13 pins), 08-DPLL-2 (88 pins), 09-DPLL-3 (13 pins), 10-JTAG (82 pins), 11-DisplayPort (38 pins), 12-USB Phy (24 pins), 13-Experimental (14 pins), 14-FPGA-01a (44 pins), 15-FPGA-01b (51 pins), 16-FPGA-02a (40 pins), 17-FPGA-02b (49 pins), 18-Power-P3V3 (17 pins), 19-Power-P5V (16 pins), 20-Power-P1V8 (17 pins), 21-M2_GNSS (18 pins), 22-1G_SFP (52 pins)
P1V8: 01-PCIe (C4.1 U1.6), 06-General I2C Devices (5 pins), 08-DPLL-2 (13 pins), 10-JTAG (9 pins), 11-DisplayPort (6 pins), 12-USB Phy (10 pins), 15-FPGA-01b (JA1.D1 JA1.D2), 16-FPGA-02a (JA2.A44 JA2.B42), 17-FPGA-02b (JA2.C44 JA2.D42), 20-Power-P1V8 (8 pins)
P3V3: 01-PCIe (22 pins), 02-USER_IO (9 pins), 03-USER_IO_STATUS (D3.2 D9.2 D10.2 D11.2), 05-Front Panel SFP+ (30 pins), 06-General I2C Devices (35 pins), 07-DPLL-1 (5 pins), 08-DPLL-2 (46 pins), 09-DPLL-3 (8 pins), 10-JTAG (12 pins), 11-DisplayPort (16 pins), 12-USB Phy (R27.2), 13-Experimental (6 pins), 14-FPGA-01a (6 pins), 16-FPGA-02a (JA2.B59 JA2.B60), 17-FPGA-02b (6 pins), 18-Power-P3V3 (9 pins), 20-Power-P1V8 (D20.2 R262.2), 21-M2_GNSS (13 pins), 22-1G_SFP (30 pins)
P5V: 12-USB Phy (5 pins), 13-Experimental (R187.2), 14-FPGA-01a (JA1.A59 JA1.A60 JA1.B60), 15-FPGA-01b (7 pins), 18-Power-P3V3 (R164.2), 19-Power-P5V (9 pins)
USB_PWRD_VCCIO: 01-PCIe (U1.10), 10-JTAG (42 pins)
ANT1_IN: 02-USER_IO (R33.1), 15-FPGA-01b (JA1.D16)
ANT1_IO_OUT: 02-USER_IO (R14.2 R125.1 U8.9), 16-FPGA-02a (JA2.B58)
ANT1_OUT: 02-USER_IO (R25.1), 14-FPGA-01a (JA1.A17)
ANT2_IN: 02-USER_IO (R131.1), 17-FPGA-02b (JA2.C56)
ANT2_IO_OUT: 02-USER_IO (R29.2 R129.1 U12.9), 17-FPGA-02b (JA2.D57)
ANT2_OUT: 02-USER_IO (R130.1), 17-FPGA-02b (JA2.C59)
ANT3_IN: 13-Experimental (U24.3), 16-FPGA-02a (JA2.B49)
ANT3_IO_IN: 13-Experimental (R104.2 U24.7), 17-FPGA-02b (JA2.D52)
ANT3_IO_OUT: 13-Experimental (R103.2 U24.1), 17-FPGA-02b (JA2.D46)
ANT3_OUT: 13-Experimental (U24.2), 17-FPGA-02b (JA2.D44)
ANT4_IN: 13-Experimental (R234.1), 16-FPGA-02a (JA2.B57)
ANT4_OUT: 13-Experimental (R232.1), 17-FPGA-02b (JA2.D45)
DPLL_CLKIN_0_N: 07-DPLL-1 (U4.2), 09-DPLL-3 (C283.2)
DPLL_CLKIN_0_P: 07-DPLL-1 (U4.1), 09-DPLL-3 (C282.2)
DPLL_CLKIN_1_N: 01-PCIe (C54.2 R41.1 R109.2), 07-DPLL-1 (U4.4)
DPLL_CLKIN_1_P: 01-PCIe (C53.2 R40.1 R108.2), 07-DPLL-1 (U4.3)
DPLL_CLKIN_2_N: 07-DPLL-1 (U4.6), 09-DPLL-3 (C281.1)
DPLL_CLKIN_2_P: 07-DPLL-1 (U4.5), 09-DPLL-3 (C279.1)
DPLL_CLKIN_3_N: 07-DPLL-1 (U4.8), 09-DPLL-3 (R235.1)
DPLL_CLKIN_3_P: 07-DPLL-1 (U4.7), 09-DPLL-3 (R200.1)
DPLL_CLKIN_4_N: 07-DPLL-1 (U4.12), 09-DPLL-3 (R238.1)
DPLL_CLKIN_4_P: 07-DPLL-1 (U4.11), 09-DPLL-3 (R236.1)
DPLL_CLKIN_5_N: 07-DPLL-1 (U4.14), 09-DPLL-3 (R293.2)
DPLL_CLKIN_5_P: 07-DPLL-1 (U4.13), 08-DPLL-2 (R181.1)
DPLL_CLKIN_6_N: 07-DPLL-1 (U4.16), 09-DPLL-3 (R294.2)
DPLL_CLKIN_6_P: 07-DPLL-1 (U4.15), 21-M2_GNSS (R268.2 R272.2)
DPLL_CLKOUT0_N: 07-DPLL-1 (U4.59), 09-DPLL-3 (C268.1 R110.2)
DPLL_CLKOUT0_P: 07-DPLL-1 (U4.60), 09-DPLL-3 (C266.1 R110.1)
DPLL_CLKOUT1_N: 07-DPLL-1 (U4.57), 09-DPLL-3 (C271.1 R289.2)
DPLL_CLKOUT1_P: 07-DPLL-1 (U4.56), 09-DPLL-3 (C270.1 R289.1)
DPLL_CLKOUT2_N: 07-DPLL-1 (U4.52), 09-DPLL-3 (C274.1 R290.2)
DPLL_CLKOUT2_P: 07-DPLL-1 (U4.53), 09-DPLL-3 (C272.1 R290.1)
DPLL_CLKOUT6_N: 07-DPLL-1 (U4.35), 09-DPLL-3 (C280.1 R292.2)
DPLL_CLKOUT6_P: 07-DPLL-1 (U4.36), 09-DPLL-3 (C278.1 R292.1)
DPLL_CLKOUT7_N: 07-DPLL-1 (U4.33), 09-DPLL-3 (C277.1 R291.1)
DPLL_CLKOUT7_P: 07-DPLL-1 (U4.32), 09-DPLL-3 (C276.1 R291.2)
DPLL_CS: 07-DPLL-1 (R54.2 U4.23), 09-DPLL-3 (R201.2 R243.2)
DPLL_EEPROM_SCL: 06-General I2C Devices (R147.2), 07-DPLL-1 (P5.3 R77.2 U4.18 U25.6)
DPLL_EEPROM_SDA: 06-General I2C Devices (R146.2), 07-DPLL-1 (P5.4 R58.2 U4.17 U25.5)
DPLL_GPIO0: 07-DPLL-1 (U4.64), 09-DPLL-3 (R240.1)
DPLL_GPIO1: 07-DPLL-1 (U4.47), 09-DPLL-3 (R242.1)
DPLL_GPIO4: 07-DPLL-1 (U4.58), 09-DPLL-3 (R267.1)
DPLL_GPIO5: 07-DPLL-1 (U4.51), 09-DPLL-3 (R266.1)
DPLL_OSCI: 07-DPLL-1 (U4.67), 08-DPLL-2 (C249.2)
DPLL_SCLK: 07-DPLL-1 (R51.2 U4.20), 09-DPLL-3 (R197.2 R237.2)
DPLL_SDI: 07-DPLL-1 (R53.2 U4.22), 09-DPLL-3 (R198.2 R239.2)
DPLL_SDIO: 07-DPLL-1 (R52.2 U4.21), 09-DPLL-3 (R199.2 R241.2)
DPLL_XO: 07-DPLL-1 (U4.72), 08-DPLL-2 (R265.2)
FAN_TACH: 13-Experimental (R45.2 R46.2), 17-FPGA-02b (JA2.C51)
FPGA_FAN_PWM: 13-Experimental (Q4.1 R188.2), 17-FPGA-02b (JA2.D58)
FPGA_I2C_MUX_RST: 06-General I2C Devices (R121.1 R209.1), 17-FPGA-02b (JA2.C55)
FPGA_SIT5501_HLPR_SCL: 06-General I2C Devices (R231.1), 16-FPGA-02a (JA2.B45)
FPGA_SIT5501_HLPR_SDA: 06-General I2C Devices (R230.1), 16-FPGA-02a (JA2.B46)
FPGA_SIT5501_PLL_SCL: 06-General I2C Devices (R229.1), 17-FPGA-02b (JA2.C46)
FPGA_SIT5501_PLL_SDA: 06-General I2C Devices (R228.1), 17-FPGA-02b (JA2.C50)
FPGA_UART_RX: 10-JTAG (U16.5), 16-FPGA-02a (JA2.A56)
FPGA_UART_TX: 10-JTAG (U16.4), 16-FPGA-02a (JA2.A58)
GTH_DP0_C2M_N: 05-Front Panel SFP+ (J5.P2_12), 16-FPGA-02a (JA2.B10)
GTH_DP0_C2M_P: 05-Front Panel SFP+ (J5.P2_13), 16-FPGA-02a (JA2.B9)
GTH_DP0_M2C_N: 05-Front Panel SFP+ (J5.P2_19), 17-FPGA-02b (JA2.D10)
GTH_DP0_M2C_P: 05-Front Panel SFP+ (J5.P2_18), 17-FPGA-02b (JA2.D9)
GTH_DP1_C2M_N: 05-Front Panel SFP+ (J5.P1_12), 17-FPGA-02b (JA2.D2)
GTH_DP1_C2M_P: 05-Front Panel SFP+ (J5.P1_13), 17-FPGA-02b (JA2.D1)
GTH_DP1_M2C_N: 05-Front Panel SFP+ (J5.P1_19), 17-FPGA-02b (JA2.C8)
GTH_DP1_M2C_P: 05-Front Panel SFP+ (J5.P1_18), 17-FPGA-02b (JA2.C7)
GTH_DP2_C2M_N: 01-PCIe (P2.B20), 16-FPGA-02a (JA2.B2)
GTH_DP2_C2M_P: 01-PCIe (P2.B19), 16-FPGA-02a (JA2.B1)
GTH_DP2_M2C_N: 01-PCIe (C49.2), 16-FPGA-02a (JA2.B6)
GTH_DP2_M2C_P: 01-PCIe (C48.2), 16-FPGA-02a (JA2.B5)
GTH_DP3_C2M_N: 01-PCIe (P2.B14), 17-FPGA-02b (JA2.D6)
GTH_DP3_C2M_P: 01-PCIe (P2.B15), 17-FPGA-02b (JA2.D5)
GTH_DP3_M2C_N: 01-PCIe (C47.2), 16-FPGA-02a (JA2.A4)
GTH_DP3_M2C_P: 01-PCIe (C46.2), 16-FPGA-02a (JA2.A3)
GTH_REFCLK0_C2M_N: 01-PCIe (C145.2 R9.2), 17-FPGA-02b (JA2.C4)
GTH_REFCLK0_C2M_P: 01-PCIe (C57.2 R9.1), 17-FPGA-02b (JA2.C3)
GTH_REFCLK1_C2M_N: 09-DPLL-3 (C277.2 R193.2), 16-FPGA-02a (JA2.A8)
GTH_REFCLK1_C2M_P: 09-DPLL-3 (C276.2 R193.1), 16-FPGA-02a (JA2.A7)
GTR_DP1_M2C_N: 11-DisplayPort (C135.1), 14-FPGA-01a (JA1.A48)
GTR_DP1_M2C_P: 11-DisplayPort (C134.1), 14-FPGA-01a (JA1.A47)
HDA01: 15-FPGA-01b (JA1.D17), 21-M2_GNSS (J12.50)
HDA02: 15-FPGA-01b (JA1.D18), 21-M2_GNSS (R295.2)
HDA06: 15-FPGA-01b (JA1.C18), 21-M2_GNSS (J12.62)
HDA07: 15-FPGA-01b (JA1.C19), 21-M2_GNSS (J12.64)
HDA08: 15-FPGA-01b (JA1.C20), 21-M2_GNSS (J12.20)
HDA12: 09-DPLL-3 (R293.1), 15-FPGA-01b (JA1.D20)
HDA13: 09-DPLL-3 (R294.1), 15-FPGA-01b (JA1.D21)
HDA14: 15-FPGA-01b (JA1.D22), 21-M2_GNSS (R296.2)
HDA16_CC: 09-DPLL-3 (R245.1), 14-FPGA-01a (JA1.B21)
HDA17: 14-FPGA-01a (JA1.B22), 21-M2_GNSS (J12.22)
HDA18: 06-General I2C Devices (R140.1), 15-FPGA-01b (JA1.C22)
HDA19: 06-General I2C Devices (R139.1), 15-FPGA-01b (JA1.C23)
HDA20: 07-DPLL-1 (U4.45), 15-FPGA-01b (JA1.C24)
HDB17: 07-DPLL-1 (U4.28), 16-FPGA-02a (JA2.B50)
HDC01: 17-FPGA-02b (JA2.D53), 21-M2_GNSS (J12.48)
HDC02: 17-FPGA-02b (JA2.D54), 21-M2_GNSS (J12.44 R271.1)
HDC14: 07-DPLL-1 (R263.1), 16-FPGA-02a (JA2.B54)
HDC18: 09-DPLL-3 (R239.1), 16-FPGA-02a (JA2.A54)
HDC19: 09-DPLL-3 (R237.1), 16-FPGA-02a (JA2.A55)
HDC22: 09-DPLL-3 (R243.1), 16-FPGA-02a (JA2.A59)
HDC23: 09-DPLL-3 (R241.1), 16-FPGA-02a (JA2.A60)
HPA00_CC_N: 09-DPLL-3 (R196.1), 15-FPGA-01b (JA1.C4)
HPA00_CC_P: 09-DPLL-3 (R195.1), 15-FPGA-01b (JA1.C3)
HPA10_CC_N: 09-DPLL-3 (C280.2 R194.2), 15-FPGA-01b (JA1.C13)
HPA10_CC_P: 09-DPLL-3 (C278.2 R194.1), 15-FPGA-01b (JA1.C12)
HPA_CLK0_N: 09-DPLL-3 (C268.2 R189.2), 14-FPGA-01a (JA1.A7)
HPA_CLK0_P: 09-DPLL-3 (C266.2 R189.1), 14-FPGA-01a (JA1.A6)
HPB06_N: 16-FPGA-02a (JA2.A21), 22-1G_SFP (J5.P3_12)
HPB06_P: 16-FPGA-02a (JA2.A20), 22-1G_SFP (J5.P3_13)
HPB08_N: 16-FPGA-02a (JA2.A15), 22-1G_SFP (J5.P3_19)
HPB08_P: 16-FPGA-02a (JA2.A14), 22-1G_SFP (J5.P3_18)
HPB_CLK0_N: 09-DPLL-3 (C271.2 R190.2), 17-FPGA-02b (JA2.D19)
HPB_CLK0_P: 09-DPLL-3 (C270.2 R190.1), 17-FPGA-02b (JA2.D18)
HPC15_CC_N: 16-FPGA-02a (JA2.A39), 22-1G_SFP (J5.P4_12)
HPC15_CC_P: 16-FPGA-02a (JA2.A38), 22-1G_SFP (J5.P4_13)
HPC19_N: 16-FPGA-02a (JA2.A33), 22-1G_SFP (J5.P4_19)
HPC19_P: 16-FPGA-02a (JA2.A32), 22-1G_SFP (J5.P4_18)
HPC_CLK0_N: 09-DPLL-3 (C274.2 R192.2), 17-FPGA-02b (JA2.C42)
HPC_CLK0_P: 09-DPLL-3 (C272.2 R192.1), 17-FPGA-02b (JA2.C41)
I2C_SCK: 06-General I2C Devices (R207.2 U39.2), 15-FPGA-01b (JA1.D42)
I2C_SDA: 06-General I2C Devices (R206.2 U39.3), 15-FPGA-01b (JA1.C42)
JTAG_TCK_C2M: 10-JTAG (R74.1 R219.1 R223.2), 14-FPGA-01a (JA1.A25), 15-FPGA-01b (R133.2)
JTAG_TDI_C2M: 10-JTAG (R222.1 U10.14), 14-FPGA-01a (JA1.A24)
JTAG_TDO_M2C: 10-JTAG (R220.1 U5.4), 14-FPGA-01a (JA1.A23)
JTAG_TMS_C2M: 10-JTAG (R221.1 R224.2 U5.5), 14-FPGA-01a (JA1.A22)
LED1: 03-USER_IO_STATUS (R35.1), 16-FPGA-02a (JA2.A46)
LED2: 03-USER_IO_STATUS (R36.1), 17-FPGA-02b (JA2.C47)
LED3: 03-USER_IO_STATUS (R38.1), 16-FPGA-02a (JA2.B48)
LED4: 03-USER_IO_STATUS (R39.1), 16-FPGA-02a (JA2.B44)
M2_SCL: 06-General I2C Devices (R66.1 U40.16), 21-M2_GNSS (J12.40 R269.1)
M2_SDA: 06-General I2C Devices (R65.1 U40.15), 21-M2_GNSS (J12.42 R270.1)
MIO27: 11-DisplayPort (U17.8), 15-FPGA-01b (JA1.D29)
MIO28: 11-DisplayPort (U19.9), 15-FPGA-01b (JA1.D30)
MIO29: 11-DisplayPort (U19.8), 15-FPGA-01b (JA1.C30)
MIO30: 11-DisplayPort (U17.9), 15-FPGA-01b (JA1.C31)
MIO39: 12-USB Phy (R31.1), 14-FPGA-01a (JA1.B33)
MIO50: 12-USB Phy (R28.1), 14-FPGA-01a (JA1.B36)
MIO51: 09-DPLL-3 (R201.1), 14-FPGA-01a (JA1.B37)
MIO52: 12-USB Phy (U23.1), 15-FPGA-01b (JA1.D36)
MIO53: 12-USB Phy (U23.31), 15-FPGA-01b (JA1.D37)
MIO54: 12-USB Phy (U23.5), 15-FPGA-01b (JA1.D38)
MIO55: 12-USB Phy (U23.2), 15-FPGA-01b (JA1.C38)
MIO56: 12-USB Phy (U23.3), 15-FPGA-01b (JA1.C39)
MIO57: 12-USB Phy (U23.4), 15-FPGA-01b (JA1.C40)
MIO58: 12-USB Phy (U23.29), 14-FPGA-01a (JA1.B40)
MIO59: 12-USB Phy (U23.6), 14-FPGA-01a (JA1.B41)
MIO60: 12-USB Phy (U23.7), 14-FPGA-01a (JA1.B42)
MIO61: 12-USB Phy (U23.9), 14-FPGA-01a (JA1.A38)
MIO62: 12-USB Phy (U23.10), 14-FPGA-01a (JA1.A39)
MIO63: 12-USB Phy (U23.13), 14-FPGA-01a (JA1.A40)
MIO70: 09-DPLL-3 (R199.1), 14-FPGA-01a (JA1.B44)
MIO71: 09-DPLL-3 (R198.1), 14-FPGA-01a (JA1.B45)
MIO72: 09-DPLL-3 (R197.1), 14-FPGA-01a (JA1.B46)
MIO73: 12-USB Phy (R100.2 U23.27), 14-FPGA-01a (JA1.A42)
MODE0_C2M: 14-FPGA-01a (JA1.A27), 15-FPGA-01b (R137.2)
MODE1_C2M: 14-FPGA-01a (JA1.A28), 15-FPGA-01b (R136.2)
MODE2_C2M: 14-FPGA-01a (JA1.A29), 15-FPGA-01b (R135.2)
MODE3_C2M: 14-FPGA-01a (JA1.A30), 15-FPGA-01b (R134.2)
P5V_PGOOD: 14-FPGA-01a (JA1.B26), 19-Power-P5V (R251.1 U29.4)
PCIE_PERST: 01-PCIe (R22.1 R48.2 U1.8), 07-DPLL-1 (P3.1 R55.1), 16-FPGA-02a (JA2.A50), 21-M2_GNSS (J12.67)
PL_SCL: 06-General I2C Devices (R215.1), 14-FPGA-01a (JA1.A15)
PL_SDA: 06-General I2C Devices (R214.1), 14-FPGA-01a (JA1.A16)
PS_ERROR_OUT_M2C: 14-FPGA-01a (JA1.B24), 15-FPGA-01b (TP2.1)
PS_ERROR_STATUS_M2C: 14-FPGA-01a (JA1.B25), 15-FPGA-01b (TP3.1)
PS_POR_B: 10-JTAG (U9.6), 15-FPGA-01b (JA1.C15)
PS_SRST_C2M_B: 01-PCIe (R1.2), 10-JTAG (J7.14 U9.4), 15-FPGA-01b (JA1.C16)
SFP1_MOD_ABS: 05-Front Panel SFP+ (J5.P1_6 R5.2), 16-FPGA-02a (JA2.A48)
SFP1_SCL: 05-Front Panel SFP+ (J5.P1_5 R4.2), 06-General I2C Devices (R120.1 U27.3)
SFP1_SDA: 05-Front Panel SFP+ (J5.P1_4 R3.2), 06-General I2C Devices (R119.1 U27.2)
SFP1_TXDISABLE: 05-Front Panel SFP+ (J5.P1_3 R112.2 R165.2), 16-FPGA-02a (JA2.A47)
SFP2_MOD_ABS: 05-Front Panel SFP+ (J5.P2_6 R13.2), 16-FPGA-02a (JA2.A52)
SFP2_SCL: 05-Front Panel SFP+ (J5.P2_5 R12.2), 06-General I2C Devices (R118.1 U27.5)
SFP2_SDA: 05-Front Panel SFP+ (J5.P2_4 R11.2), 06-General I2C Devices (R117.1 U27.4)
SFP2_TXDISABLE: 05-Front Panel SFP+ (J5.P2_3 R122.2 R166.2), 17-FPGA-02b (JA2.C52)
SFP3_MOD_ABS: 16-FPGA-02a (JA2.B53), 22-1G_SFP (J5.P3_6 R277.2)
SFP3_SCL: 06-General I2C Devices (R116.1 U27.8), 22-1G_SFP (J5.P3_5 R276.2)
SFP3_SDA: 06-General I2C Devices (R115.1 U27.7), 22-1G_SFP (J5.P3_4 R275.2)
SFP3_TXDISABLE: 17-FPGA-02b (JA2.C54), 22-1G_SFP (J5.P3_3 R273.2 R280.2)
SFP4_MOD_ABS: 16-FPGA-02a (JA2.B52), 22-1G_SFP (J5.P4_6 R285.2)
SFP4_SCL: 06-General I2C Devices (R114.1 U27.10), 22-1G_SFP (J5.P4_5 R284.2)
SFP4_SDA: 06-General I2C Devices (R113.1 U27.9), 22-1G_SFP (J5.P4_4 R283.2)
SFP4_TXDISABLE: 16-FPGA-02a (JA2.B56), 22-1G_SFP (J5.P4_3 R281.2 R288.2)
SiT5501_HLPR_SCL: 06-General I2C Devices (R231.2 U40.5), 09-DPLL-3 (R249.1 Y3.3)
SiT5501_HLPR_SDA: 06-General I2C Devices (R230.2 U40.4), 09-DPLL-3 (R250.1 Y3.2)
SiT5501_PLL_SCL: 06-General I2C Devices (R229.2 U40.7), 08-DPLL-2 (Y2.3)
SiT5501_PLL_SDA: 06-General I2C Devices (R228.2 U40.6), 08-DPLL-2 (Y2.2)
SOM_UART1_RXD: 10-JTAG (U14.5), 14-FPGA-01a (JA1.B30)
SOM_UART1_TXD: 10-JTAG (U14.4), 14-FPGA-01a (JA1.B29)
VCCOEN_PL_M2C: 14-FPGA-01a (JA1.A20), 18-Power-P3V3 (R157.1 R172.2), 20-Power-P1V8 (R257.1)